# Altium schematic sheet Sheet2.SchDoc
size A2; Organization: Altium Limited; Address1: L3, 12a Rodborough Rd; Address2: Frenchs Forest; Address3: NSW; Address4: Australia 2086
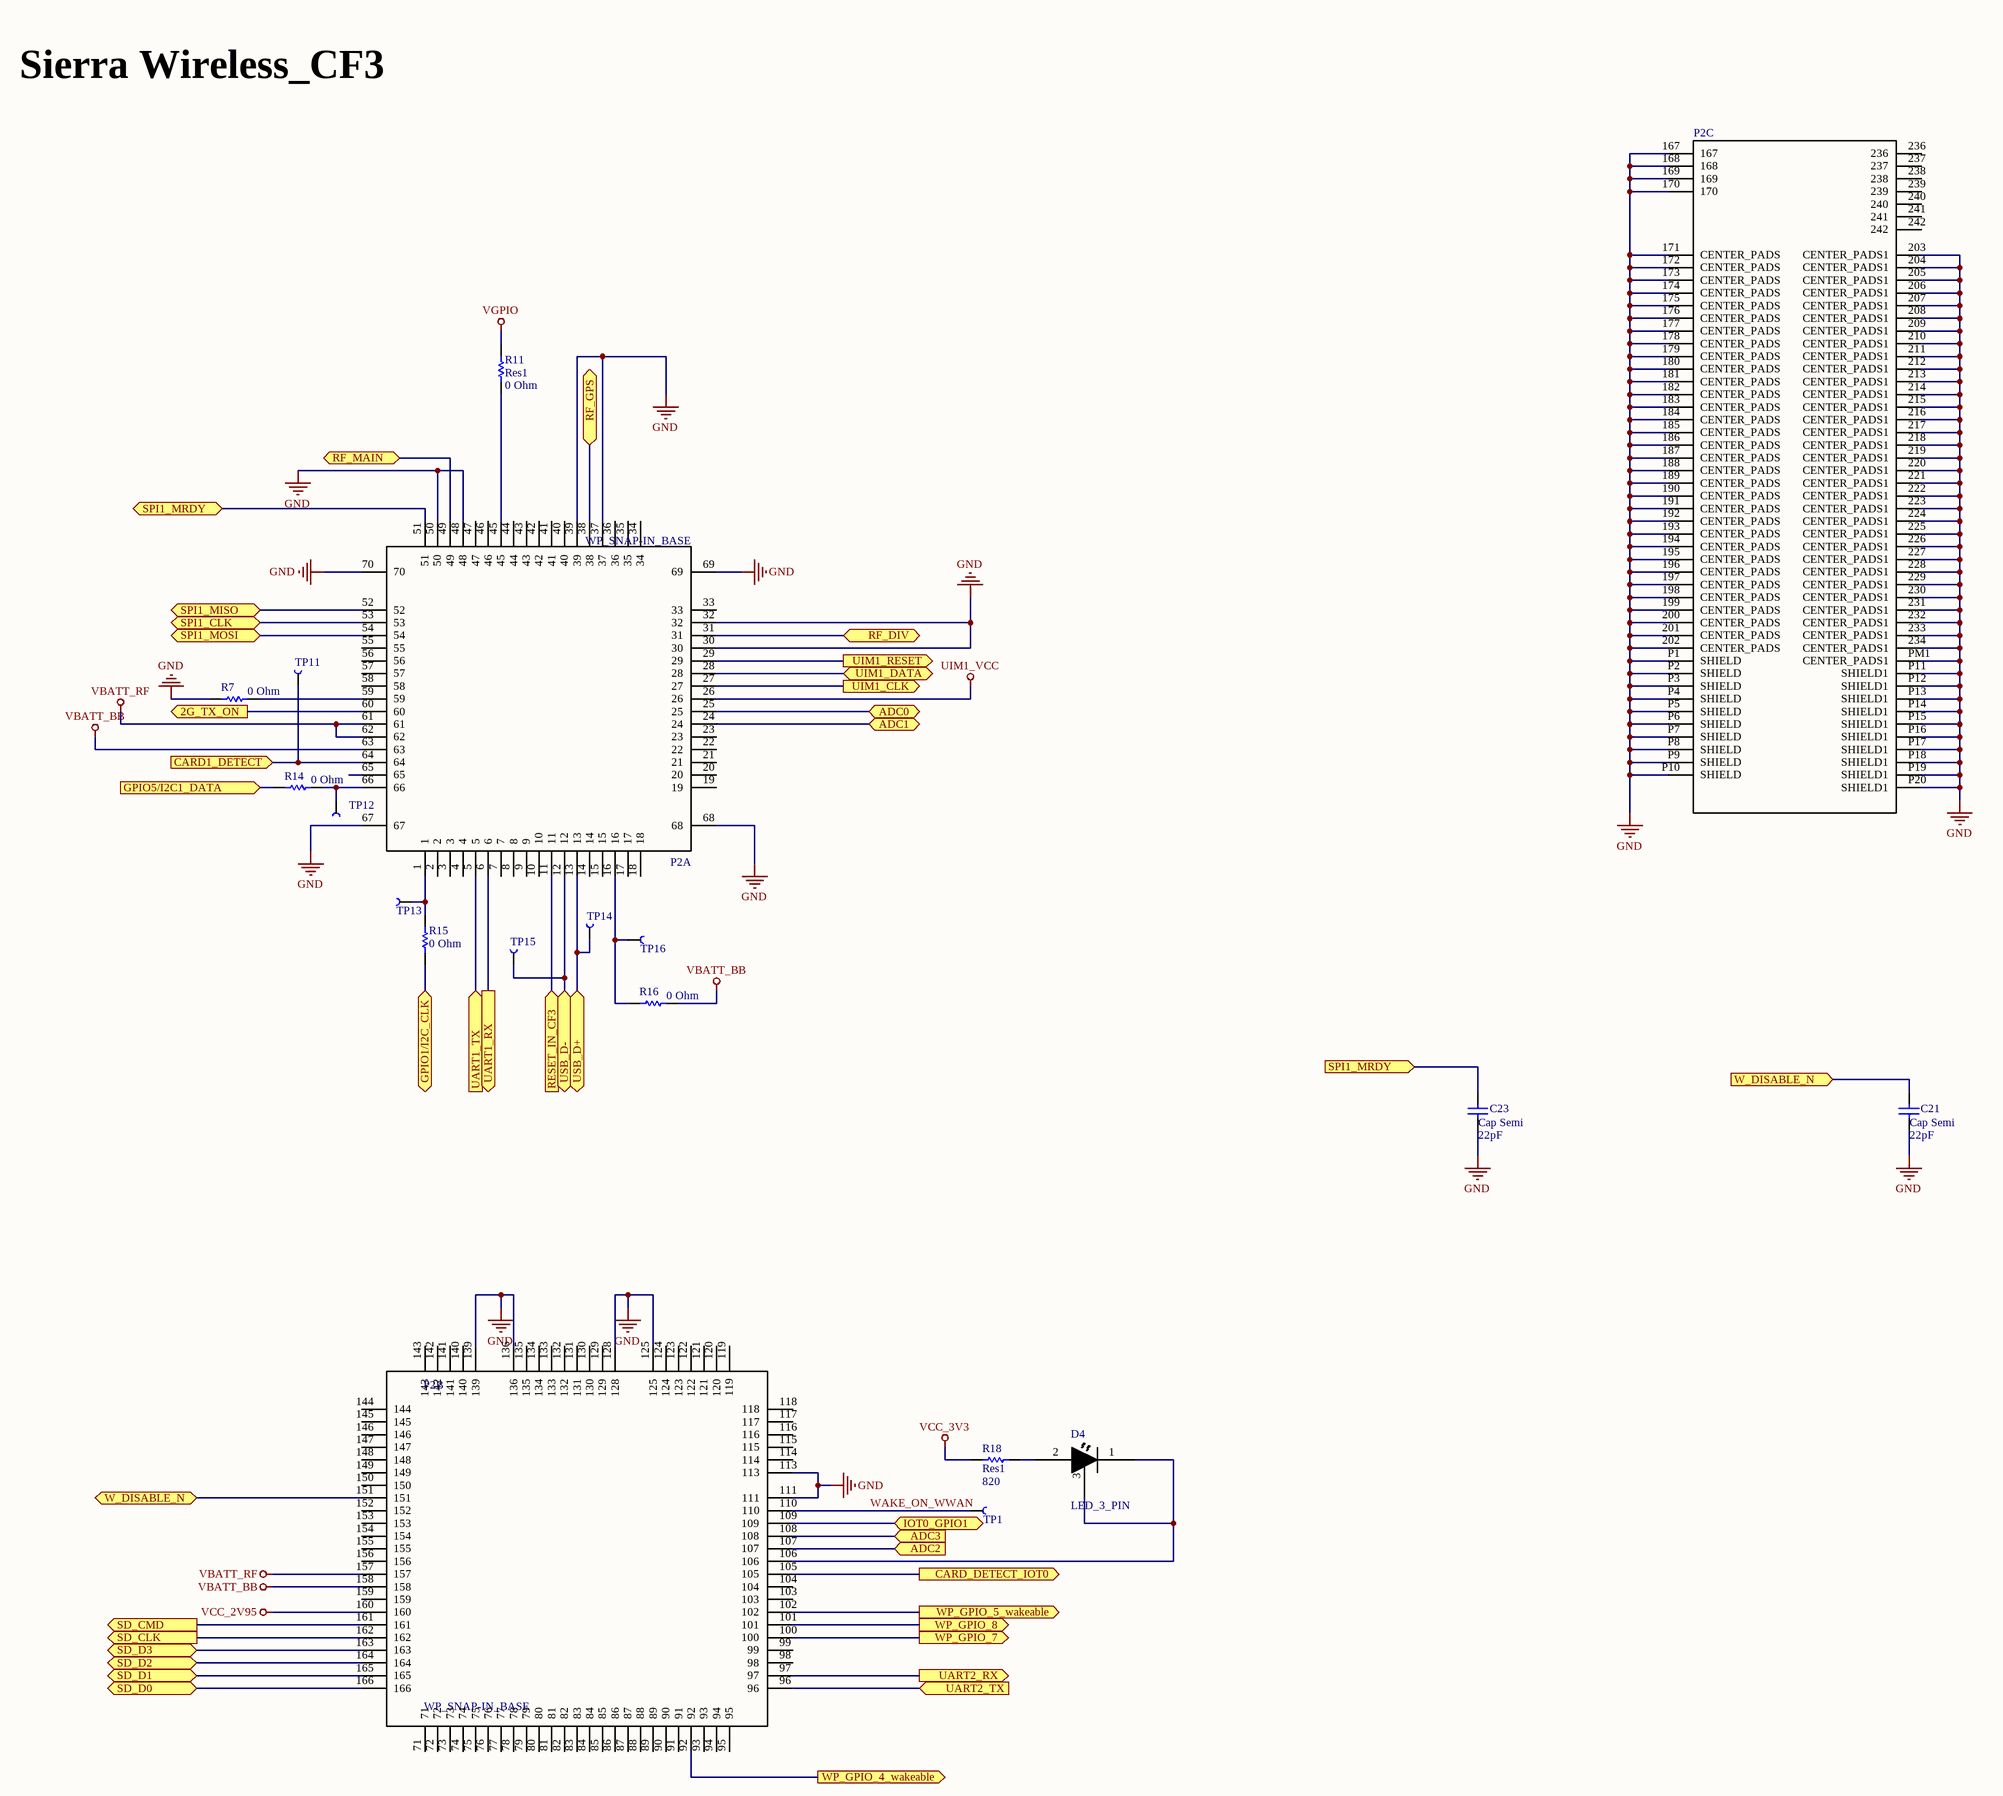
[diagram p0: Sheet2.SchDoc]

## Parts
C21  Cap Semi  value 22pF  [CAP 0402/1005]
C23  Cap Semi  value 22pF  [CAP 0402/1005]
D4  LED_3_PIN  [LED_3_PIN]
P2  WP_SNAP-IN_BASE  [*SIERRA_WP_SNAP-IN_BASE_WP_SNAP-IN_BASE(Primary)]  (parts A,B,C of 3)
R7  value 0 Ohm  [RES 0402/1005]  (hidden comment: Res1)
R11  Res1  value 0 Ohm  [RES 0402/1005]
R14  value 0 Ohm  [RES 0402/1005]  (hidden comment: Res1)
R15  value 0 Ohm  [RES 0402/1005]  (hidden comment: Res1)
R16  value 0 Ohm  [RES 0402/1005]  (hidden comment: Res1)
R18  Res1  value 820  [RES 0402/1005]
TP1  TestPoint  [TestPoint]  (value not drawn)
TP11  TestPoint  [TestPoint]  (value not drawn)
TP12  TestPoint  [TestPoint]  (value not drawn)
TP13  TestPoint  [TestPoint]  (value not drawn)
TP14  TestPoint  [TestPoint]  (value not drawn)
TP15  TestPoint  [TestPoint]  (value not drawn)
TP16  TestPoint  [TestPoint]  (value not drawn)

## Ports
2G_TX_ON (out), ADC0 (bidir), ADC1 (bidir), ADC2 (in), ADC3 (in), CARD1_DETECT (in), CARD_DETECT_IOT0 (out), GPIO1/I2C_CLK (bidir), GPIO5/I2C1_DATA (in), IOT0_GPIO1 (bidir), RESET_IN_CF3 (in), RF_DIV (bidir), RF_GPS (bidir), RF_MAIN (bidir), SD_CLK (out), SD_CMD (out), SD_D0 (bidir), SD_D1 (bidir), SD_D2 (bidir), SD_D3 (bidir), SPI1_CLK (bidir), SPI1_MISO (bidir), SPI1_MOSI (bidir), SPI1_MRDY (bidir), SPI1_MRDY (in), UART1_RX (out), UART1_TX (in), UART2_RX (out), UART2_TX (in), UIM1_CLK (out), UIM1_DATA (bidir), UIM1_RESET (out), USB_D+ (bidir), USB_D- (bidir), W_DISABLE_N (bidir), W_DISABLE_N (in), WP_GPIO_4_wakeable (out), WP_GPIO_5_wakeable (out), WP_GPIO_7 (out), WP_GPIO_8 (out)

## Nets
GND: C21.1 C23.1 P2.30 P2.32 P2.37 P2.39 P2.48 P2.50 P2.67 P2.68 P2.69 P2.70 P2.111 P2.113 P2.125 P2.128 P2.136 P2.139 P2.167 P2.168 P2.169 P2.170 P2.171(CENTER_PADS) P2.172(CENTER_PADS) P2.173(CENTER_PADS) P2.174(CENTER_PADS) P2.175(CENTER_PADS) P2.176(CENTER_PADS) P2.177(CENTER_PADS) P2.178(CENTER_PADS) P2.179(CENTER_PADS) P2.180(CENTER_PADS) P2.181(CENTER_PADS) P2.182(CENTER_PADS) P2.183(CENTER_PADS) P2.184(CENTER_PADS) P2.185(CENTER_PADS) P2.186(CENTER_PADS) P2.187(CENTER_PADS) P2.188(CENTER_PADS) P2.189(CENTER_PADS) P2.190(CENTER_PADS) P2.191(CENTER_PADS) P2.192(CENTER_PADS) P2.193(CENTER_PADS) P2.194(CENTER_PADS) P2.195(CENTER_PADS) P2.196(CENTER_PADS) P2.197(CENTER_PADS) P2.198(CENTER_PADS) P2.199(CENTER_PADS) P2.200(CENTER_PADS) P2.201(CENTER_PADS) P2.202(CENTER_PADS) P2.203(CENTER_PADS1) P2.204(CENTER_PADS1) P2.205(CENTER_PADS1) P2.206(CENTER_PADS1) P2.207(CENTER_PADS1) P2.208(CENTER_PADS1) P2.209(CENTER_PADS1) P2.210(CENTER_PADS1) P2.211(CENTER_PADS1) P2.212(CENTER_PADS1) P2.213(CENTER_PADS1) P2.214(CENTER_PADS1) P2.215(CENTER_PADS1) P2.216(CENTER_PADS1) P2.217(CENTER_PADS1) P2.218(CENTER_PADS1) P2.219(CENTER_PADS1) P2.220(CENTER_PADS1) P2.221(CENTER_PADS1) P2.222(CENTER_PADS1) P2.223(CENTER_PADS1) P2.224(CENTER_PADS1) P2.225(CENTER_PADS1) P2.226(CENTER_PADS1) P2.227(CENTER_PADS1) P2.228(CENTER_PADS1) P2.229(CENTER_PADS1) P2.230(CENTER_PADS1) P2.231(CENTER_PADS1) P2.232(CENTER_PADS1) P2.233(CENTER_PADS1) P2.234(CENTER_PADS1) P2.P1(SHIELD) P2.P2(SHIELD) P2.P3(SHIELD) P2.P4(SHIELD) P2.P5(SHIELD) P2.P6(SHIELD) P2.P7(SHIELD) P2.P8(SHIELD) P2.P9(SHIELD) P2.P10(SHIELD) P2.P11(SHIELD1) P2.P12(SHIELD1) P2.P13(SHIELD1) P2.P14(SHIELD1) P2.P15(SHIELD1) P2.P16(SHIELD1) P2.P17(SHIELD1) P2.P18(SHIELD1) P2.P19(SHIELD1) P2.P20(SHIELD1) P2.PM1(CENTER_PADS1) R7.2
UIM1_VCC: P2.26
VBATT_BB: P2.63 P2.158 R16.1
VBATT_RF: P2.61 P2.62 P2.157
VCC_2V95: P2.160
VCC_3V3: R18.2
VGPIO: R11.1
2G_TX_ON: P2.60 ; port 2G_TX_ON
ADC0: P2.25 ; port ADC0
ADC1: P2.24 ; port ADC1
ADC2: P2.107 ; port ADC2
ADC3: P2.108 ; port ADC3
CARD1_DETECT: P2.64 TP11.1(TP) ; port CARD1_DETECT
CARD_DETECT_IOT0: P2.105 ; port CARD_DETECT_IOT0
GPIO1/I2C_CLK: R15.2 ; port GPIO1/I2C_CLK
GPIO5/I2C1_DATA: R14.2 ; port GPIO5/I2C1_DATA
IOT0_GPIO1: P2.109 ; port IOT0_GPIO1
RESET_IN_CF3: P2.11 ; port RESET_IN_CF3
RF_DIV: P2.31 ; port RF_DIV
RF_GPS: P2.38 ; port RF_GPS
RF_MAIN: P2.49 ; port RF_MAIN
SD_CLK: P2.162 ; port SD_CLK
SD_CMD: P2.161 ; port SD_CMD
SD_D0: P2.166 ; port SD_D0
SD_D1: P2.165 ; port SD_D1
SD_D2: P2.164 ; port SD_D2
SD_D3: P2.163 ; port SD_D3
SPI1_CLK: P2.53 ; port SPI1_CLK
SPI1_MISO: P2.52 ; port SPI1_MISO
SPI1_MOSI: P2.54 ; port SPI1_MOSI
SPI1_MRDY: C23.2 P2.51 ; port SPI1_MRDY
UART1_RX: P2.6 ; port UART1_RX
UART1_TX: P2.5 ; port UART1_TX
UART2_RX: P2.97 ; port UART2_RX
UART2_TX: P2.96 ; port UART2_TX
UIM1_CLK: P2.27 ; port UIM1_CLK
UIM1_DATA: P2.28 ; port UIM1_DATA
UIM1_RESET: P2.29 ; port UIM1_RESET
USB_D+: P2.13 TP14.1(TP) ; port USB_D+
USB_D-: P2.12 TP15.1(TP) ; port USB_D-
W_DISABLE_N: C21.2 P2.151 ; port W_DISABLE_N
WAKE_ON_WWAN: P2.110 TP1.1(TP)
WP_GPIO_4_wakeable: P2.92 ; port WP_GPIO_4_wakeable
WP_GPIO_5_wakeable: P2.102 ; port WP_GPIO_5_wakeable
WP_GPIO_7: P2.100 ; port WP_GPIO_7
WP_GPIO_8: P2.101 ; port WP_GPIO_8
NetD4_1: D4.1 D4.3 P2.106
NetD4_2: D4.2 R18.1
NetP2_1: P2.1 R15.1 TP13.1(TP)
NetP2_16: P2.16 R16.2 TP16.1(TP)
NetP2_45: P2.45 R11.2
NetP2_59: P2.59 R7.1
NetP2_66: P2.66 R14.1 TP12.1(TP)

Not connected (* = marked no-connect by the designer): P2 2 3 4 7 8 9 10 14 15 17 18 19 20 21 22 23 33 34 35 36 40 41 42 43 44 46 47 55 56 57 58 65 71 72 73 74 75 76 77 78 79 80 81 82 83 84 85 86 87 88 89 90 91 93 94 95 98 99 103 104 114 115 116 117 118 119 120 121 122 123 124 129 130 131 132 133 134 135 140 141 142 143 144 145 146 147 148 149 150 152 153 154 155 156 159 236 237 238 239 240 241 242

## Notes on the sheet
- Sierra Wireless_CF3
- Title
- Size:
- Date:
- File:
- A2
- Number:
- Time:
- Revision:
- Sheet
- of

## Library data of the parts
C21 C23 = Cap Semi: CAP CER 22PF 50V NP0 0402; Part Number: UMK105CG220JV-F; Available: Obsolete; Published: 8-Jun-2000; LatestRevisionDate: 29-May-2009; LatestRevisionNote: IPC-7351 Footprint Added.; PackageReference: C1206; PackageDescription: Chip Capacitor; Supplier Link: https://www.digikey.com/product-detail/en/taiyo-yuden/UMK105CG220JV-F/587-1203-1-ND/930980
D4 = LED_3_PIN: Yellow-Green 573nm LED Indication - Discrete 2V 2-SMD, No Lead; Part Number: 12-21SYGC/S530-E2/TR8; Supplier Link: https://www.digikey.com/product-detail/en/everlight-electronics-co-ltd/12-21SYGC-S530-E2-TR8/1080-1451-1-ND/5308153
P2 = WP_SNAP-IN_BASE: Snap-In Socket Base For Wp Series Mcu; Part Number: WP SNAP-IN BASE; MF: Sierra Wireless; Availability: Unavailable; SnapEDA_Link: https://www.snapeda.com/parts/WP%20SNAP-IN%20BASE/Sierra%20Wireless/view-part/?ref=snap; Price: None; Package: None; Value: *; Supplier Link: https://www.digikey.com/product-detail/en/sierra-wireless/WP-SNAP-IN-BASE_6000636/1645-1026-1-ND/6565779
R7 R11 R14-R16 = Res1: 0 Ohms Jumper  Chip Resistor 0402 (1005 Metric) Automotive AEC-Q200 Metal Element; Part Number: RK73Z1ETTP; Published: 8-Jun-2000; LatestRevisionDate: 17-Jul-2002; LatestRevisionNote: Re-released for DXP Platform.; PackageReference: AXIAL-0.3; PackageDescription: Axial Device, Thru-Hole; 2 Leads; 0.3 in Pin Spacing; Supplier Link: https://www.digikey.com/product-detail/en/koa-speer-electronics-inc/RK73Z1ETTP/2019-RK73Z1ETTPCT-ND/9846740
R18 = Res1: 820 Ohms ±5% 0.1W, 1/10W Chip Resistor 0402 (1005 Metric) Automotive AEC-Q200 Thick Film; Part Number: RK73B1ETTP821J; Published: 8-Jun-2000; LatestRevisionDate: 17-Jul-2002; LatestRevisionNote: Re-released for DXP Platform.; PackageReference: AXIAL-0.3; PackageDescription: Axial Device, Thru-Hole; 2 Leads; 0.3 in Pin Spacing; Supplier Link: https://www.digikey.com/product-detail/en/koa-speer-electronics-inc/RK73B1ETTP821J/2019-RK73B1ETTP821JCT-ND/9846073